# EAGLE design DC-DC-Brick (EAGLE 8.4.1)
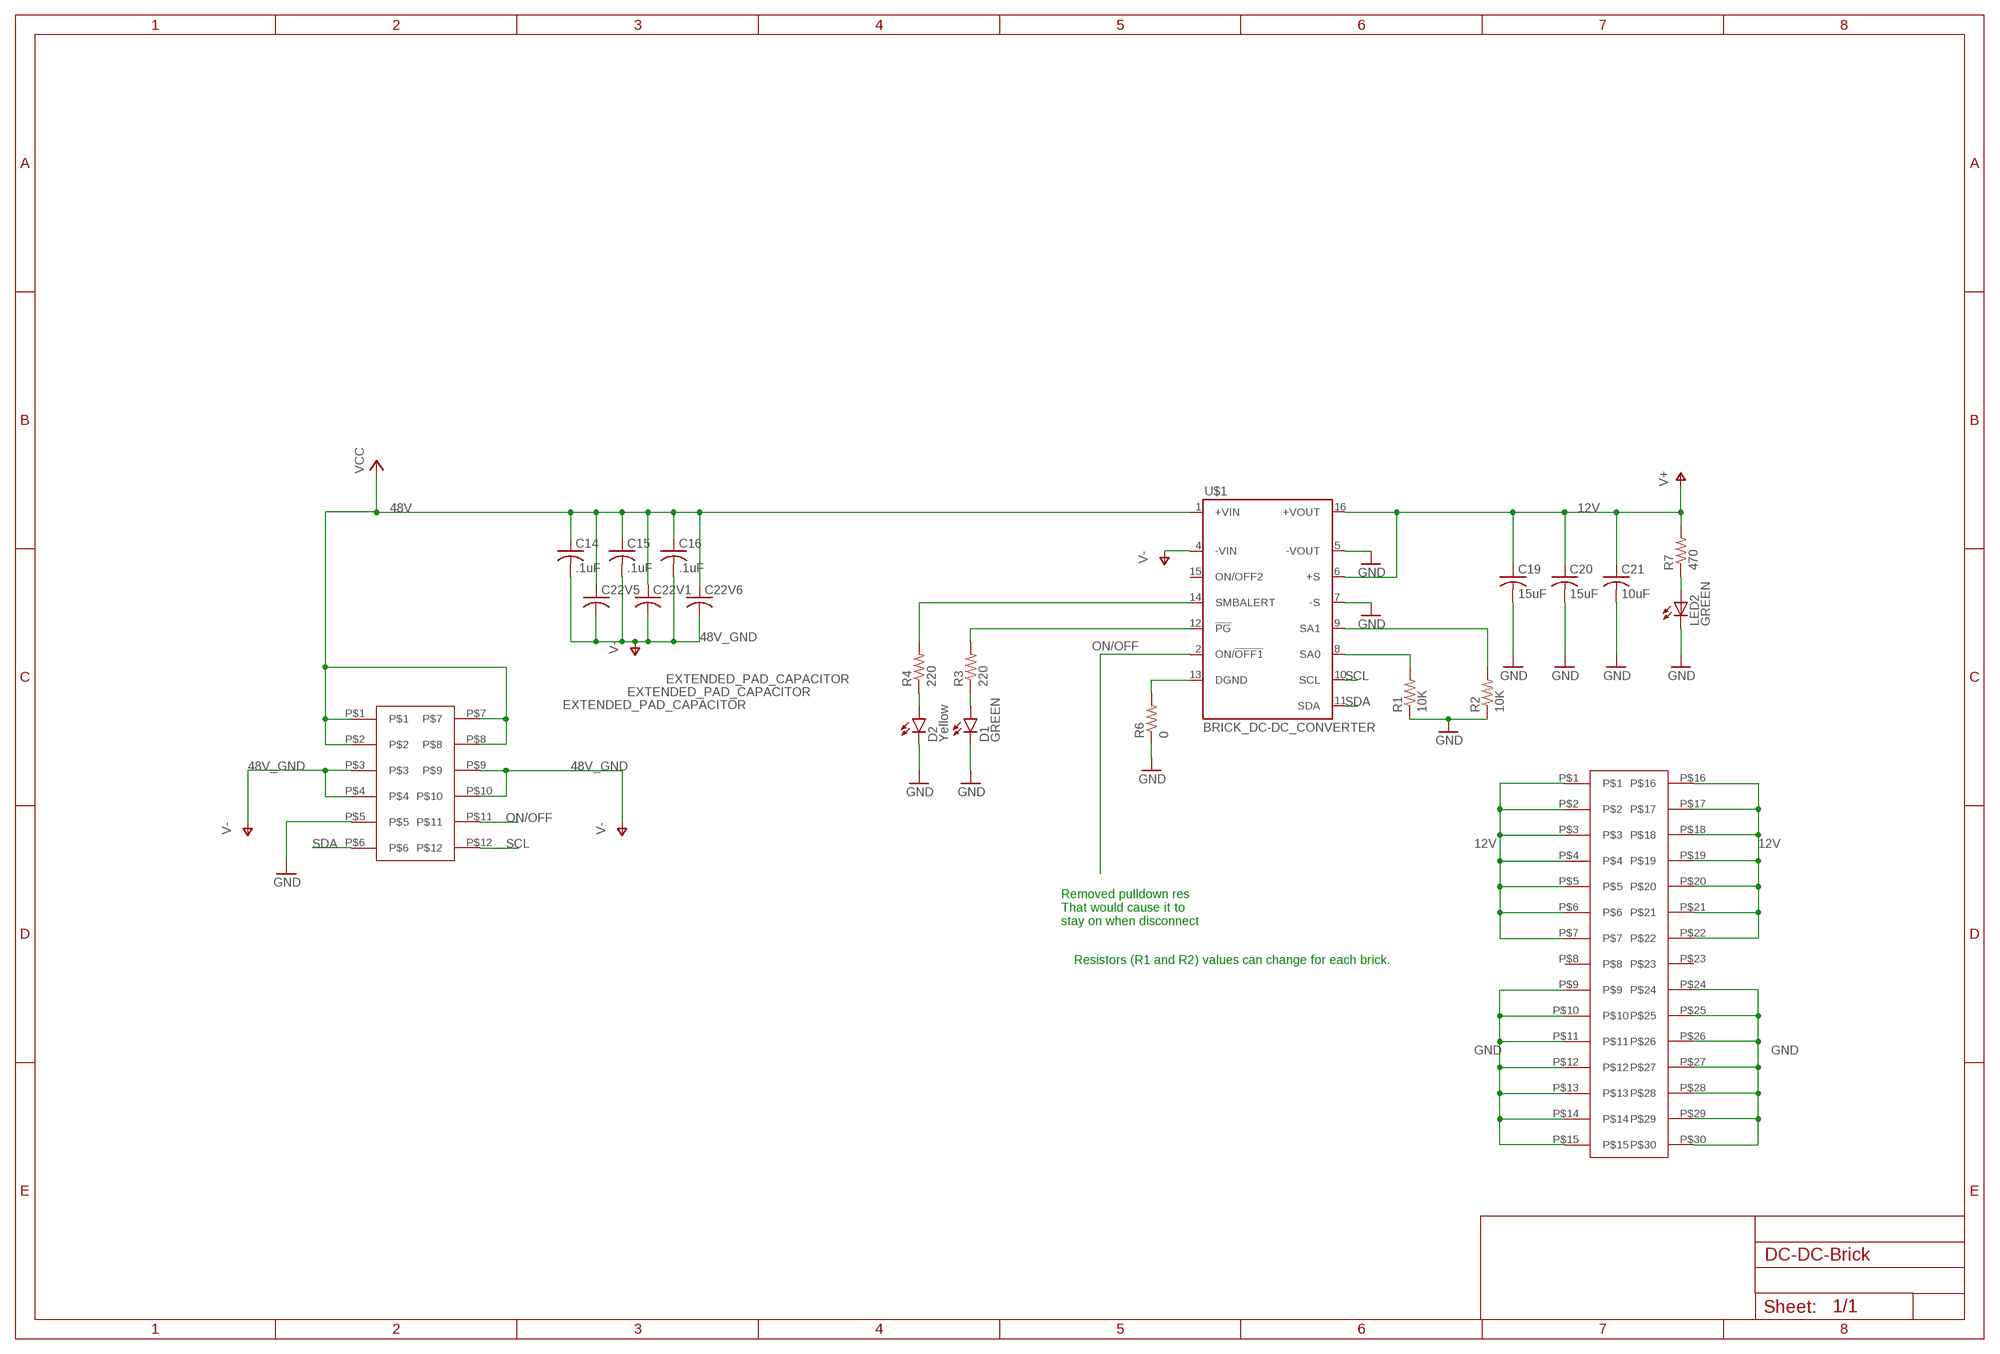
[diagram p0: schematic, sheet 1]

## Parts
C14  .1uF  C-USC0603  [C0603]
C15  .1uF  C-USC0603  [C0603]
C16  .1uF  C-USC0603  [C0603]
C19  15uF  C-USC3216  [C3216]
C20  15uF  C-USC3216  [C3216]
C21  10uF  C-USC0603  [C0603]
C22V1  EXTENDED_PAD_CAPACITOR  [MODIFIED-NICHICON-UX-8X10]
C22V5  EXTENDED_PAD_CAPACITOR  [MODIFIED-NICHICON-UX-8X10]
C22V6  EXTENDED_PAD_CAPACITOR  [MODIFIED-NICHICON-UX-8X10]
D1  GREEN  LED-GREEN0603  [LED-0603]
D2  Yellow  LED-YELLOW0603  [LED-0603]
LED2  GREEN  LED0603  [LED-0603]
R1  10K  10KOHM-1/10W-1%(0603)0603  [0603-RES]
R2  10K  10KOHM-1/10W-1%(0603)0603  [0603-RES]
R3  220  1KOHM-1/10W-1%(0603)  [0603-RES]
R4  220  1KOHM-1/10W-1%(0603)  [0603-RES]
R6  0  1KOHM-1/10W-1%(0603)  [0603-RES]
R7  470  470OHM1/10W1%(0603)  [0603-RES]
U$1  BRICK_DC-DC_CONVERTER  [BRICK_DC-DC_CONVERTER]
U$2  POWER_BRICK_CONNECTORS(2X6)  [POWER_BRICK_CONNECTORS(2X6)]
U$3  POWER_BRICK_CONNECTORS(2X15)  [POWER_BRICK_CONNECTORS(2X15)]

## Nets
12V: C19.1 C20.1 C21.1 R7.2 U$1.6(+S) U$1.16(+VOUT) U$3.P$1 U$3.P$2 U$3.P$3 U$3.P$4 U$3.P$5 U$3.P$6 U$3.P$7 U$3.P$16 U$3.P$17 U$3.P$18 U$3.P$19 U$3.P$20 U$3.P$21 U$3.P$22 ; supply symbol labelled V+
48V: C14.1 C15.1 C16.1 C22V1.P$3 C22V5.P$3 C22V6.P$3 U$1.1(+VIN) U$2.P$1 U$2.P$2 U$2.P$7 U$2.P$8 ; supply symbol labelled VCC
48V_GND: C14.2 C15.2 C16.2 C22V1.P$1 C22V5.P$1 C22V6.P$1 U$1.4(-VIN) U$2.P$3 U$2.P$4 U$2.P$9 U$2.P$10 ; supply symbol labelled V-
GND: C19.2 C20.2 C21.2 D1.C D2.C LED2.C R1.1 R2.1 R6.1 U$1.5(-VOUT) U$1.7(-S) U$2.P$5 U$3.P$9 U$3.P$10 U$3.P$11 U$3.P$12 U$3.P$13 U$3.P$14 U$3.P$15 U$3.P$24 U$3.P$25 U$3.P$26 U$3.P$27 U$3.P$28 U$3.P$29 U$3.P$30
N$1: R2.2 U$1.9(SA1)
N$2: R1.2 U$1.8(SA0)
N$3: R6.2 U$1.13(DGND)
N$4: D1.A R3.1
N$5: D2.A R4.1
N$6: R4.2 U$1.14(SMBALERT)
N$7: R3.2 U$1.12(!PG)
N$12: LED2.A R7.1
ON/OFF: U$1.2(ON/!OFF1) U$2.P$11
SCL: U$1.10(SCL) U$2.P$12
SDA: U$1.11(SDA) U$2.P$6
Unconnected: U$1.15(ON/OFF2) U$3.P$8 U$3.P$23

## Notes on the sheet
- Removed pulldown res
  That would cause it to
  stay on when disconnect
- Resistors (R1 and R2) values can change for each brick.

## Library data of the parts
C14-C16 C19-C21 = rcl:C-US: CAPACITOR, American symbol
C22V1 C22V5 C22V6 = PowerComponents:EXTENDED_PAD_CAPACITOR: This is an updated version of the capacitor from package: NICHICON-UX-8X10, Library: ux-capacitor. The old capacitor that was used didnt have enough space to solder on a 22uF capacitor efectivly so this one has longer and slightly wider pads.
D1 = SparkFun-LED:LED-GREEN: Various green LEDs Green LEDs used in SFE Production 0603- DIO-00821 LARGE- DIO-00862 LILYPAD- DIO-09910; PROD_ID: DIO-00821
D2 = SparkFun-LED:LED-YELLOW: Yellow SMD LEDs LilyPad 1206- DIO-09909 0603- DIO-09003 "SMART" means more efficient and expensive; PROD_ID: DIO-09003
LED2 = SparkFun:LED: LEDs Standard schematic elements and footprints for 5mm, 3mm, 1206, and 0603 sized LEDs. 5mm - Spark Fun Electronics SKU : COM-00529 (and others); BOM: INCLUDE; PARTNO: 160-1446-1-ND
R1 R2 = SparkFun-Resistors:10KOHM-1/10W-1%(0603): RES-00824; PROD_ID: RES-00824
R3 R4 R6 = SparkFun-Resistors:1KOHM-1/10W-1%(0603): RES-07856; PROD_ID: RES-07856; VALUE: 1K
R7 = SparkFun-Resistors:470OHM1/10W1%(0603): RES-07869; PROD_ID: RES-07869
U$1 = PowerComponents:BRICK_DC-DC_CONVERTER: DRQ-12/50-L48 Series 600W Digital Fully Regulated Intermediate DC-DC Bus Converter
U$2 = MotherBoardParts2:POWER_BRICK_CONNECTORS(2X6)
U$3 = MotherBoardParts2:POWER_BRICK_CONNECTORS(2X15)

## Net classes
1 I2C: width 0.254 mm

## Board
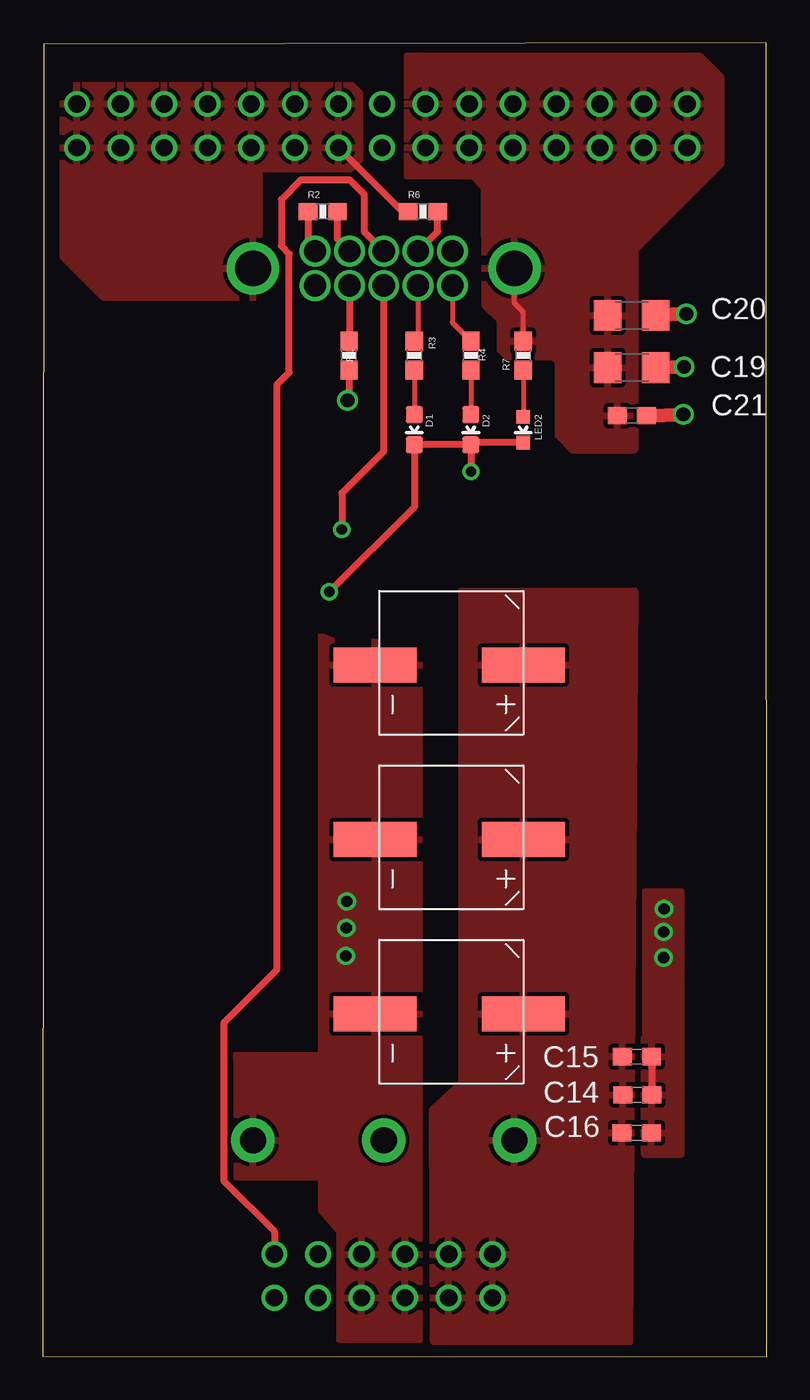
[diagram p1: board, top side]
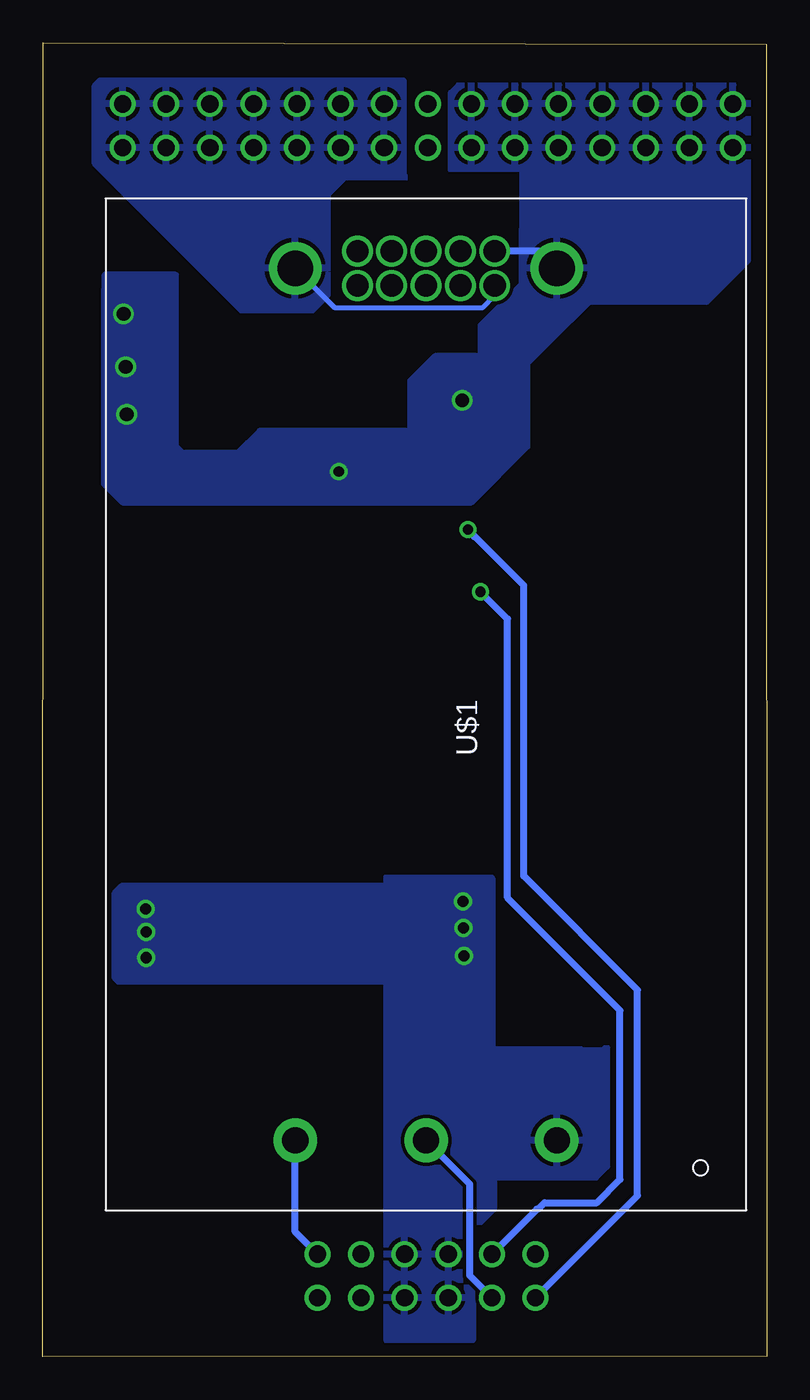
[diagram p2: board, bottom side, seen from below]

Size 42.19 x 76.53 mm. Coordinates in mm from the lower left corner, seen from the top.
Outline: 0,0.03 42.19,0 42.16,76.53 0.05,76.45 0,0.03
Copper layers (1*16): Top 0.035mm / dielectric 1.5mm / Bottom 0.035mm
Design rules "default *": minimum track width 10mil, minimum drill 24mil, track to track 8mil, track to pad 8mil, pad to pad 7mil, via to via 8mil, smd to smd 7mil, copper to edge 10mil, drill to drill 8mil, minimum pad ring 10mil, minimum via ring 8mil, stop-mask expansion 4mil, vias tented up to drill 0mil, thermal gap 10mil

### Footprints (pad centres in the part's own frame; a part is rotated, then mirrored left to right if it is on the bottom)
C0603 = smd 1.1 x 1: 1 -0.85,0; 2 0.85,0
C3216 = smd 1.6 x 1.8: 1 -1.4,0; 2 1.4,0
MODIFIED-NICHICON-UX-8X10 = smd 2.032 x 4.826: P$1 4.318,-0.254; P$3 4.318,8.382
LED-0603 = smd 1 x 1: A 0,-0.877; C 0,0.877
LED-0603' = smd 0.8 x 0.8: A 0,-0.75; C 0,0.75
0603-RES = smd 1.1 x 1: 1 -0.85,0; 2 0.85,0
BRICK_DC-DC_CONVERTER = drill 1.524 pad 2.54: 1 -25.4,7.62; 2 -25.4,0; 4 -25.4,-7.62 | drill 2.083 pad 3.048: 5 25.4,-7.62; 16 25.4,7.62 | drill 1.295 pad 1.778: 6 24.4,-4; 7 26.4,-4; 8 24.4,-2; 9 26.4,-2; 10 24.4,0; 11 26.4,0; 12 24.4,2; 13 26.4,2; 14 24.4,4; 15 26.4,4
POWER_BRICK_CONNECTORS(2X6) = drill 1: P$1 -1.27,6.35; P$2 -1.27,3.81; P$3 -1.27,1.27; P$4 -1.27,-1.27; P$5 -1.27,-3.81; P$6 -1.27,-6.35; P$7 1.27,6.35; P$8 1.27,3.81; P$9 1.27,1.27; P$10 1.27,-1.27; P$11 1.27,-3.81; P$12 1.27,-6.35
POWER_BRICK_CONNECTORS(2X15) = drill 1: P$1 -1.27,19.05; P$2 -1.27,16.51; P$3 -1.27,13.97; P$4 -1.27,11.43; P$5 -1.27,8.89; P$6 -1.27,6.35; P$7 -1.27,3.81; P$8 -1.27,1.27; P$9 -1.27,-1.27; P$10 -1.27,-3.81; P$11 -1.27,-6.35; P$12 -1.27,-8.89; P$13 -1.27,-11.43; P$14 -1.27,-13.97; P$15 -1.27,-16.51; P$16 1.27,19.05; P$17 1.27,16.51; P$18 1.27,13.97; P$19 1.27,11.43; P$20 1.27,8.89; P$21 1.27,6.35; P$22 1.27,3.81; P$23 1.27,1.27; P$24 1.27,-1.27; P$25 1.27,-3.81; P$26 1.27,-6.35; P$27 1.27,-8.89; P$28 1.27,-11.43; P$29 1.27,-13.97; P$30 1.27,-16.51

### Placement (x,y rotation side)
C14  34.65,15.24 0 top
C15  34.62,17.48 0 top
C16  34.59,13.03 0 top
C19  34.32,57.61 0 top
C20  34.32,60.66 0 top
C21  34.32,54.81 0 top
C22V1  19.61,44.6 270 top
C22V5  19.61,34.44 270 top
C22V6  19.61,24.28 270 top
D1  21.64,54 180 top
D2  24.94,54 180 top
LED2  GREEN  [LED-0603']  27.99,54 180 top
R1  17.83,58.32 90 top
R2  16.31,66.7 0 top
R3  21.64,58.32 90 top
R4  24.94,58.32 90 top
R6  22.15,66.7 0 top
R7  27.99,58.32 90 top
U$1  19.86,38 90 bottom
U$2  19.84,4.7 270 top
U$3  18.49,71.7 270 top

### Tracks (layer width: path | path; a pad name or v marks a point on that pad's centre or on a via)
12V
  Top 0.305: R7.2 27.99,60.86 27.48,61.37 U$1.16
  Bottom 0.305: U$1.16 25.2,61.11 16.56,61.11 15.86,61.81 U$1.6
  pour Top: 25.73,65.25 25.73,61.26 26.62,60.38 26.62,58.67 27.03,58.27 29.69,58.27 30,57.96 30,53.67 30.86,52.81 34.44,52.81 34.52,52.88 34.52,64.49 39.52,69.49 39.52,74.52 38.3,75.74 21.18,75.74 21.21,75.72 21.21,68.78 25.02,68.78 25.68,68.12 25.7,68.12 25.7,65.28
  pour Bottom: 21.21,74.3 21.21,68.86 21.06,68.71 24.61,68.71 25.63,67.69 25.63,61.85 26.52,60.96 30.61,60.96 39.14,69.49 39.14,74.04 38.86,74.32 21.18,74.32
48V
  Bottom 0.406: U$2.P$1 27.48,7.26 U$1.1
  pour Top: 22.76,0.86 22.71,14.4 24.41,15.98 24.41,44.58 24.38,44.6 34.47,44.6 34.49,44.58 34.19,0.84
48V_GND  (via drill 0.65)
  Top 0.406: C15.2 35.5,17.45 C14.2
  other vias: 36.2,26.09 36.17,24.74 36.17,23.24 17.7,26.52 17.68,24.97 17.65,23.34
  pour Top: 21.95,0.97 21.95,41.58 17.09,41.63 16.21,41.99 16.21,8.56 17.27,7.32 17.27,0.99 17.3,1.02
  pour Bottom: 16.31,27.41 16.31,21.84 37.77,21.84 37.97,22.05 37.97,27 37.57,27.41
  pour Top: 35.03,18.54 35.03,11.79 37.21,11.79 37.21,27.08 35.1,27.08 35.1,18.62
  pour Top: 11.28,10.46 16.69,10.46 16.81,10.59 16.81,17.32 16.61,17.53 11.18,17.53 11.28,17.42
  pour Bottom: 17.17,0.97 22.07,0.97 22.12,0.91 22.12,27.84 22.17,27.89 16.05,27.89 16.03,27.86 16.03,17.96 15.98,17.91 10.9,17.91 10.82,17.83 9.53,17.83 9.35,18.01 9.35,11.07 9.98,10.44 15.85,10.44 15.93,10.36 15.93,8.61 17.14,7.39 17.14,0.99
GND  (via drill 0.6, 0.8)
  Top 0.406: 12.24,63.49 U$1.5 | R2.1 15.46,64.8 U$1.7 | R6.1 20.95,66.7 U$3.P$24 | R1.1 17.83,55.78 v17.75,55.7 | D2.C D1.C 21.64,49.5 v16.69,44.55 | LED2.C 25.07,53.25 D2.C | D2.C v24.94,51.56 24.92,51.54 | v16.69,44.55 16.51,44.37 16.51,44.32 16.69,44.5 v16.69,44.55 | 37.64,60.76 37.63,60.75 v37.49,60.75
  Top 0.813: v37.49,60.75 C20.2 | C19.2 v37.36,57.66 | C21.2 v37.31,54.89
  Bottom 0.406: U$1.5 13.24,64.4 U$1.7 | U$2.P$5 13.41,8.59 13.33,8.59 12.95,8.97 9.91,8.97 8.56,10.31 8.56,20.17 15.11,26.72 15.11,42.98 v16.69,44.55
  pour Bottom: 38.61,61.49 38.61,50.85 37.54,49.78 17.22,49.78 13.97,53.04 13.97,57.89 9.02,62.84 9.02,63.86 11.96,66.8 13.13,66.8 14.27,65.66 14.27,62.46 16.66,60.07 16.66,58.24 19.35,58.24 20.78,56.82 20.78,53.9 29.54,53.9 30.84,52.6 34.04,52.6 34.44,53.01 34.44,62.99 38.58,62.99
  pour Top: 1.14,73.71 1.14,64.08 3.51,61.72 13.08,61.72 13.28,61.93 13.28,64.24 12.62,64.9 12.62,69.21 17.96,69.21 18.47,69.72 18.47,73.61 18.03,74.04 1.47,74.04
  pour Bottom: 1.14,74.02 1.14,63.86 3.53,61.47 14.1,61.47 14.22,61.6 14.22,69.21 18.31,69.21 18.39,69.14 18.39,73.61 17.96,74.04 1.17,74.04
N$1
  Top 0.406: U$1.9 17.16,65.1 R2.2
N$2
  Top 0.406: U$1.8 17.86,59.2 R1.2
N$3
  Top 0.406: U$1.13 23,65.53 R6.2
N$4
  Top 0.305: R3.1 D1.A
N$5
  Top 0.305: R4.1 D2.A
N$6
  Top 0.305: U$1.14 23.86,60.25 R4.2
N$7
  Top 0.305: U$1.12 21.86,59.39 R3.2
N$12
  Top 0.305: R7.1 LED2.A
ON/OFF
  Bottom 0.406: U$1.2 17.32,10.06 17.32,4.72 U$2.P$11
SCL  (via drill 0.6)
  Top 0.406: U$1.10 19.86,52.76 17.42,50.32 v17.42,48.18
  Bottom 0.406: U$2.P$12 7.54,9.37 7.54,21.36 14.17,27.99 14.17,44.93 16.99,47.75 17.04,47.75 17.04,47.8 v17.42,48.18
SDA
  Top 0.406: U$2.P$6 13.49,7.29 10.57,10.21 10.57,19.48 13.64,22.56 13.64,56.62 14.35,57.33 14.35,64.24 13.89,64.69 13.89,67.41 15.04,68.55 17.88,68.55 18.72,67.72 18.72,65.54 U$1.11